# Altium schematic sheet SCT2XX0 INVERTING STEP-DOWM.SchDoc
size A4; Organization: Altium Limited; Address1: L3, 12a Rodborough Rd; Address2: Frenchs Forest; Address3: NSW; Address4: Australia 2086
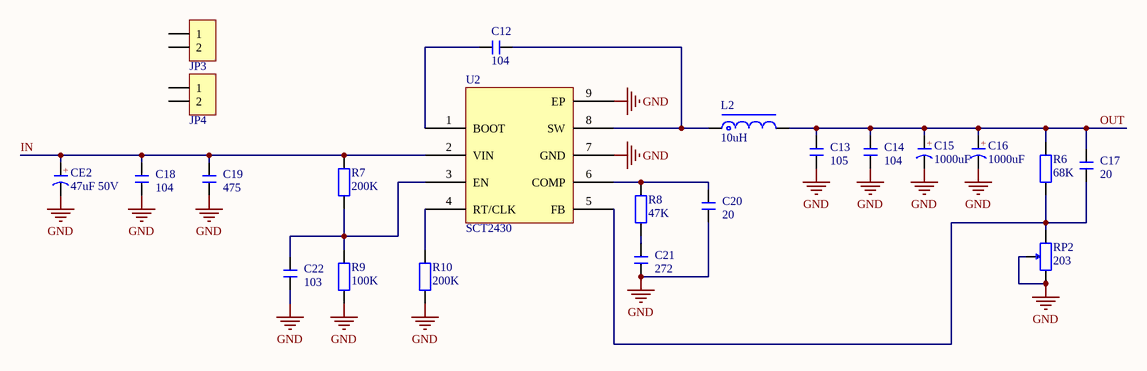
[diagram p0: SCT2XX0 INVERTING STEP-DOWM.SchDoc]

## Parts
C12  104  [C 0805_L]
C13  105  [C 0805_L]
C14  104  [C 0805_L]
C15  1000uF  [CAP 7.5*16*25]
C16  1000uF  [CAP 5.0*12.5*20]
C17  20  [C 0805_L]
C18  104  [C 0805_L]
C19  475  [C 0805_L]
C20  20  [C 0805_L]
C21  272  [C 0805_L]
C22  103  [C 0805_L]
CE2  47uF 50V  [CM C(5*5.4)]
JP3  HDR-1X2  [KF2510-LI-2P]  (value not drawn)
JP4  HDR-1X2  [KF2510-LI-2P]  (value not drawn)
L2  10uH  [CDRH127]
R6  68K  [R 0805_L]
R7  200K  [R 0805_L]
R8  47K  [R 0805_L]
R9  100K  [R 0805_L]
R10  200K  [R 0805_L]
RP2  203  [3296W]
U2  SCT2430  [ESOP8_N]

## Nets
GND: C13.1 C14.1 C15.2(K) C16.2(K) C18.1 C19.1 C20.1 C21.1 C22.1 CE2.2(K) R9.1 R10.1 RP2.1 RP2.2 U2.7(GND) U2.9(EP)
IN: C18.2 C19.2 CE2.1(A) R7.2 U2.2(VIN)
OUT: C13.2 C14.2 C15.1(A) C16.1(A) C17.2 L2.2 R6.2
NetC12_1: C12.1 U2.1(BOOT)
NetC12_2: C12.2 L2.1 U2.8(SW)
NetC17_1: C17.1 R6.1 RP2.3 U2.5(FB)
NetC20_2: C20.2 R8.2 U2.6(COMP)
NetC21_2: C21.2 R8.1
NetC22_2: C22.2 R7.1 R9.2 U2.3(EN)
NetR10_2: R10.2 U2.4(RT/CLK)

Not connected (* = marked no-connect by the designer): JP3 1 2; JP4 1 2

## Notes on the sheet
- Title
- Size:
- Date:
- File:
- A0
- Number:
- Time:
- Revision:
- Sheet
- of
- (in symbol CE) +
- (in symbol CE_SMD) +

## Library data of the parts
C12-C14 C17-C22 = C: 贴片电容; 淘宝ID: 小糖豆的小窝窝; BOM名称: 贴片电容; 下单链接: https://item.taobao.com/item.htm?ft=t&id=613637044352
C15 C16 = CE: 直插电解电容; 淘宝ID: 小糖豆的小窝窝; BOM名称: 直插电解电容; 下单链接: https://item.taobao.com/item.htm?ft=t&id=613637044352
CE2 = CE_SMD: 贴片电解电容; 淘宝ID: 小糖豆的小窝窝; BOM名称: 贴片电解电容; 下单链接: https://item.taobao.com/item.htm?ft=t&id=613637044352
JP3 JP4 = Header 2: 2P接插件; 淘宝ID: 小糖豆的小窝窝; BOM名称: 2P接插件; 下单链接: https://item.taobao.com/item.htm?ft=t&id=613637044352
L2 = L-CDRH: 功率屏蔽电感; 淘宝ID: 小糖豆的小窝窝; BOM名称: 功率屏蔽电感; 下单链接: https://item.taobao.com/item.htm?ft=t&id=613637044352
R6-R10 = R: 贴片电阻; 淘宝ID: 小糖豆的小窝窝; BOM名称: 贴片电阻; 下单链接: https://item.taobao.com/item.htm?ft=t&id=613637044352
RP2 = RP: 单联电位器; 淘宝ID: 小糖豆的小窝窝; BOM名称: 单联电位器; 下单链接: https://item.taobao.com/item.htm?ft=t&id=613637044352